# EAGLE design D-Sub Adapter (EAGLE 6.6.0)
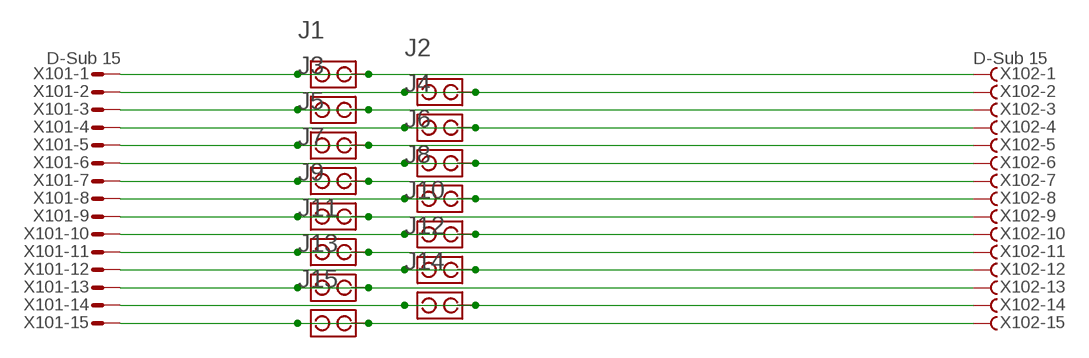
[diagram p0: schematic, sheet 1]

## Parts
J1  JUMPER  [JUMPER]
J2  JUMPER  [JUMPER]
J3  JUMPER  [JUMPER]
J4  JUMPER  [JUMPER]
J5  JUMPER  [JUMPER]
J6  JUMPER  [JUMPER]
J7  JUMPER  [JUMPER]
J8  JUMPER  [JUMPER]
J9  JUMPER  [JUMPER]
J10  JUMPER  [JUMPER]
J11  JUMPER  [JUMPER]
J12  JUMPER  [JUMPER]
J13  JUMPER  [JUMPER]
J14  JUMPER  [JUMPER]
J15  JUMPER  [JUMPER]
X101  D-Sub 15  M15HPS  [M15HP]
X102  D-Sub 15  F15HPS  [F15HP]

## Nets
N$1: J1.1 J1.2 X101.1 X102.1
N$2: J2.1 J2.2 X101.2 X102.2
N$3: J3.1 J3.2 X101.3 X102.3
N$4: J4.1 J4.2 X101.4 X102.4
N$5: J5.1 J5.2 X101.5 X102.5
N$6: J6.1 J6.2 X101.6 X102.6
N$7: J7.1 J7.2 X101.7 X102.7
N$8: J8.1 J8.2 X101.8 X102.8
N$9: J9.1 J9.2 X101.9 X102.9
N$10: J10.1 J10.2 X101.10 X102.10
N$11: J11.1 J11.2 X101.11 X102.11
N$12: J12.1 J12.2 X101.12 X102.12
N$13: J13.1 J13.2 X101.13 X102.13
N$14: J14.1 J14.2 X101.14 X102.14
N$15: J15.1 J15.2 X101.15 X102.15

## Library data of the parts
J1-J15 = MECHANIC:JUMPER
X101 = con-subd:M15?S: SUB-D; OC_FARNELL: unknown; OC_NEWARK: unknown
X102 = con-subd:F15?S: SUB-D; OC_FARNELL: unknown; OC_NEWARK: unknown

## Board
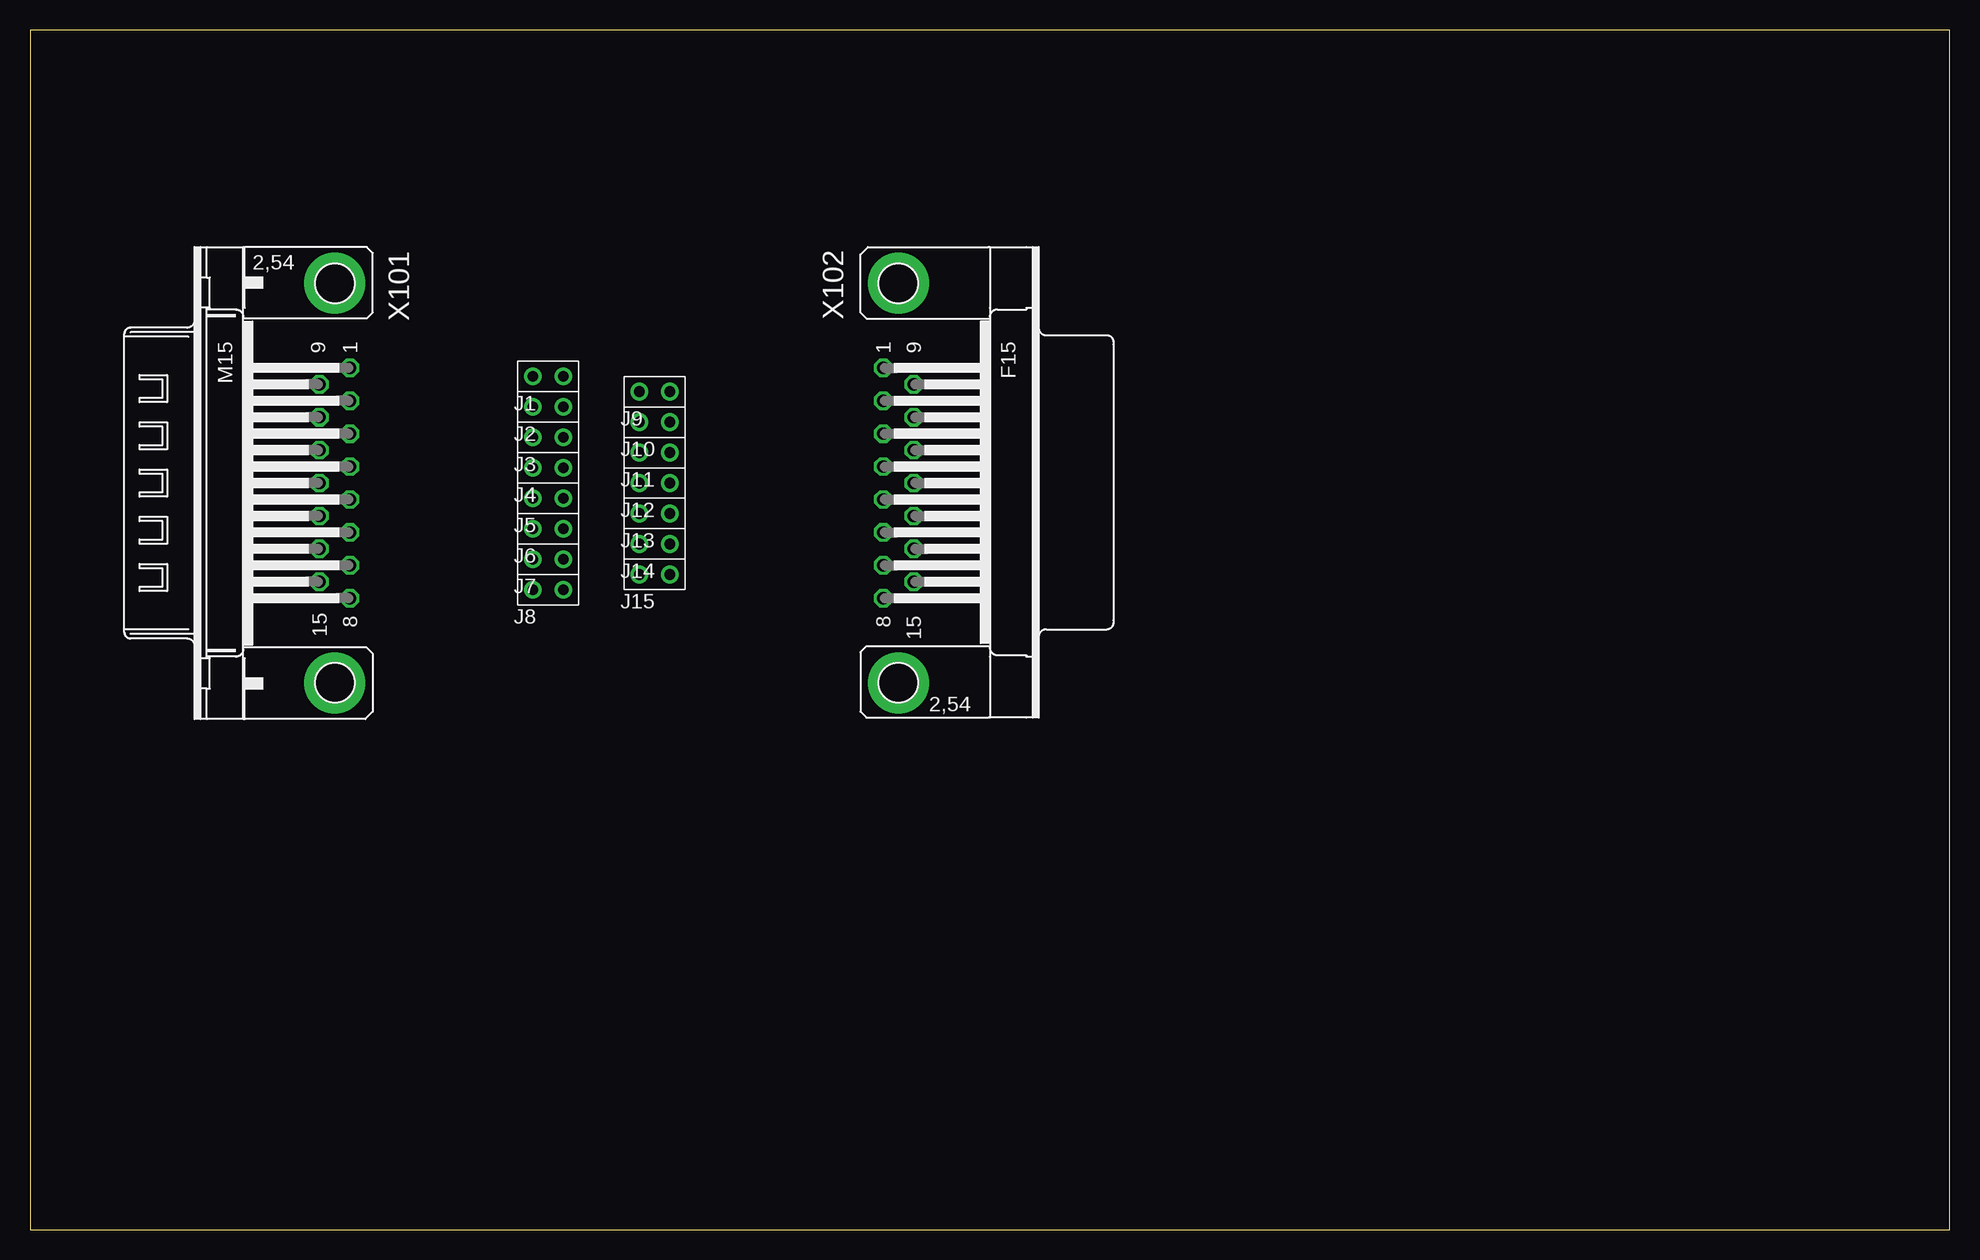
[diagram p1: board, top side]
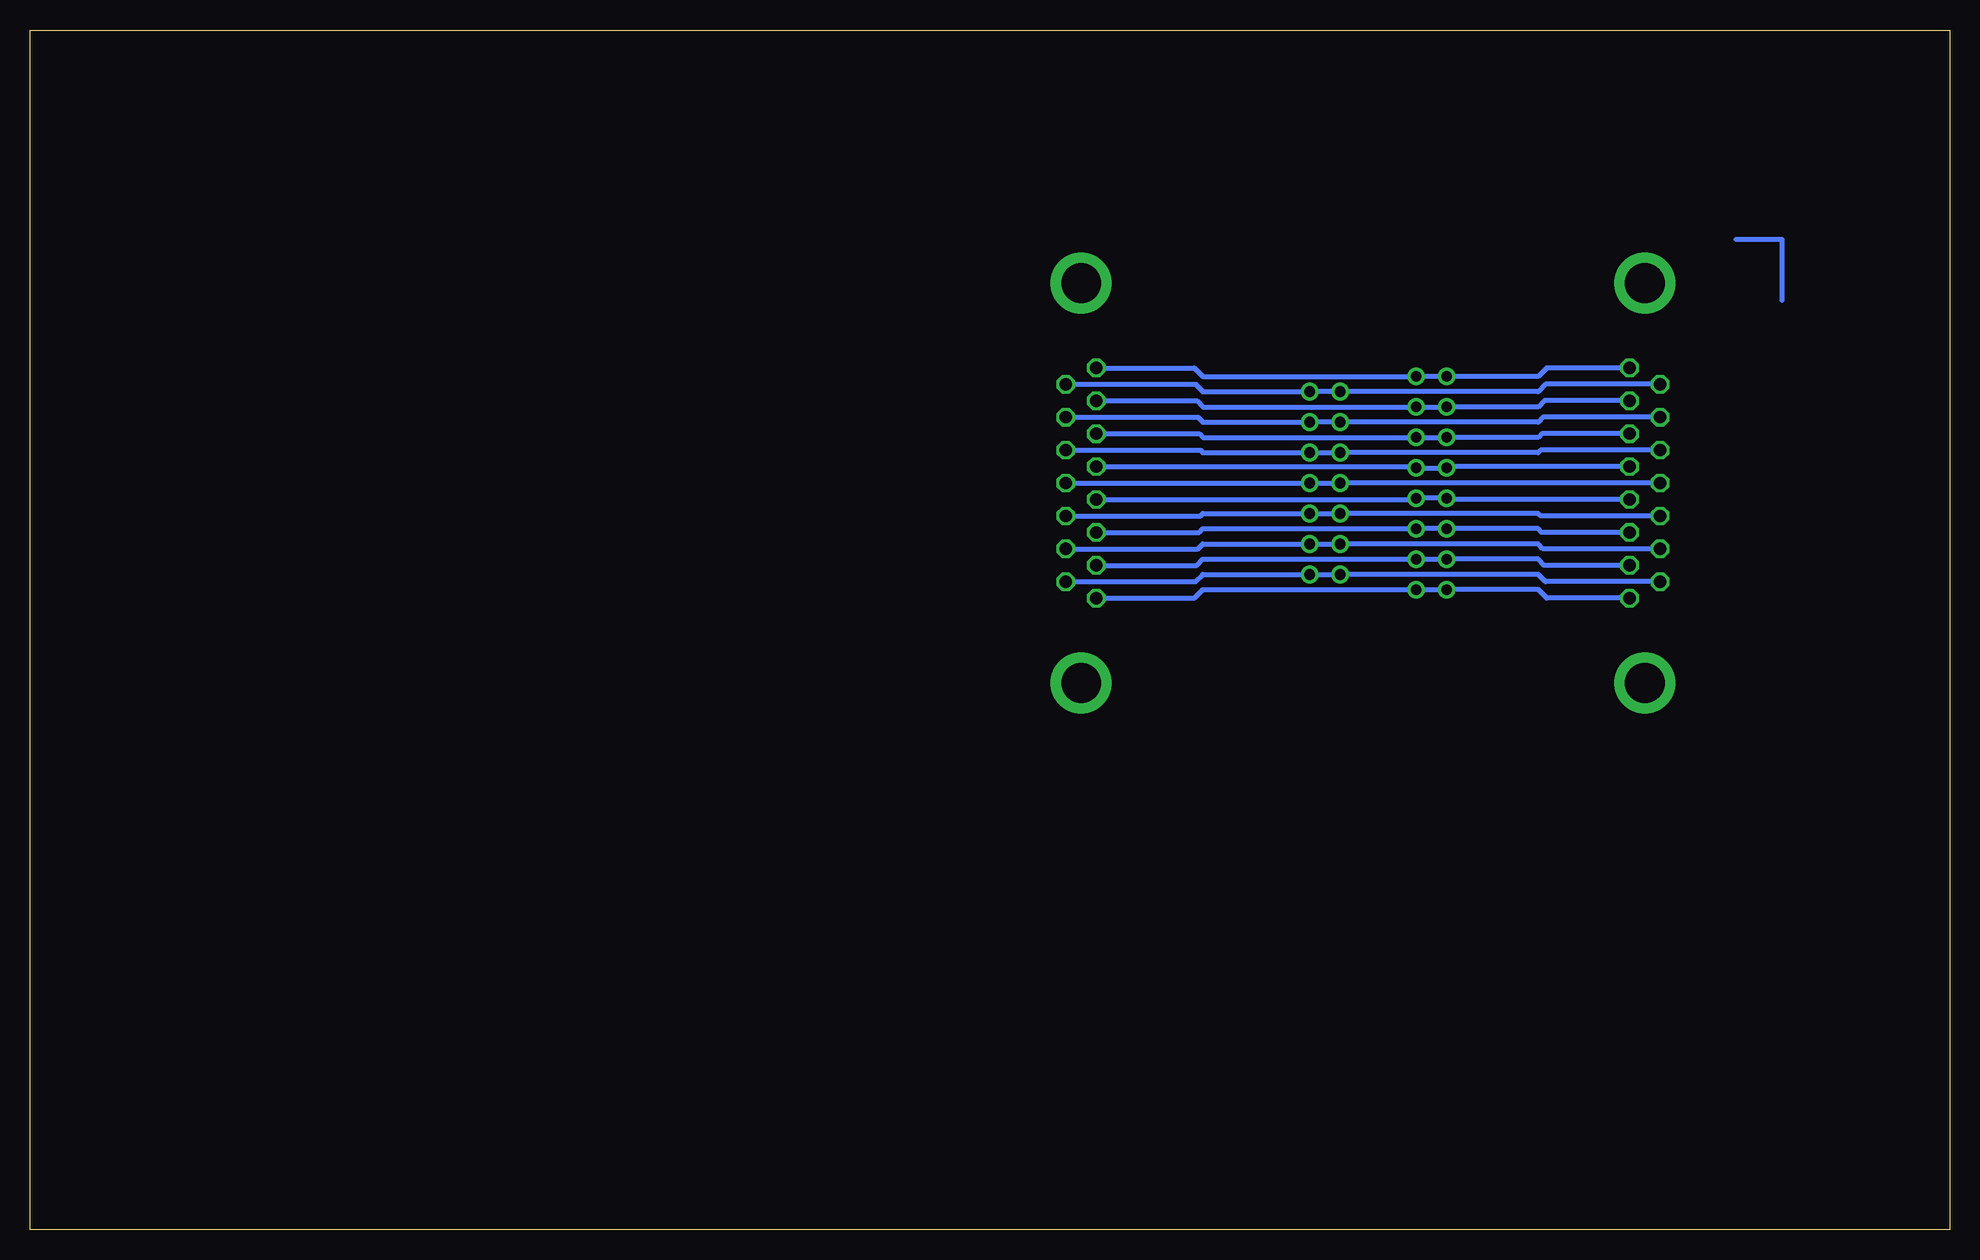
[diagram p2: board, bottom side, seen from below]

Size 160 x 100 mm. Coordinates in mm from the lower left corner, seen from the top.
Outline: 0,0 160,0 160,100 0,100 0,0
Copper layers (1*16): Top 0.035mm / dielectric 1.5mm / Bottom 0.035mm
Design rules "default": minimum track width 10mil, minimum drill 24mil, track to track 8mil, track to pad 8mil, pad to pad 8mil, via to via 8mil, smd to smd 8mil, copper to edge 40mil, drill to drill 8mil, minimum pad ring 10mil, minimum via ring 8mil, stop-mask expansion 4mil, vias tented up to drill 0mil, thermal gap 10mil

### Footprints (pad centres in the part's own frame; a part is rotated, then mirrored left to right if it is on the bottom)
JUMPER = drill 0.9 pad 1.473: 1 1.27,0; 2 -1.27,0
M15HP = drill 1.016 octagon: 1 -9.601,1.27; 2 -6.858,1.27; 3 -4.115,1.27; 4 -1.372,1.27; 5 1.372,1.27; 6 4.115,1.27; 7 6.858,1.27; 8 9.601,1.27; 9 -8.23,-1.27; 10 -5.486,-1.27; 11 -2.743,-1.27; 12 0,-1.27; 13 2.743,-1.27; 14 5.486,-1.27; 15 8.23,-1.27 | drill 3.302 pad 5.08: G1 -16.662,0; G2 16.662,0
F15HP = drill 1.016 octagon: 1 -9.601,-1.27; 2 -6.858,-1.27; 3 -4.115,-1.27; 4 -1.372,-1.27; 5 1.372,-1.27; 6 4.115,-1.27; 7 6.858,-1.27; 8 9.601,-1.27; 9 -8.23,1.27; 10 -5.486,1.27; 11 -2.743,1.27; 12 0,1.27; 13 2.743,1.27; 14 5.486,1.27; 15 8.23,1.27 | drill 3.302 pad 5.08: G1 -16.662,0; G2 16.662,0

### Placement (x,y rotation side)
J1  43.18,71.12 0 top
J2  43.18,68.58 0 top
J3  43.18,66.04 0 top
J4  43.18,63.5 0 top
J5  43.18,60.96 0 top
J6  43.18,58.42 0 top
J7  43.18,55.88 0 top
J8  43.18,53.34 0 top
J9  52.07,69.85 0 top
J10  52.07,67.31 0 top
J11  52.07,64.77 0 top
J12  52.07,62.23 0 top
J13  52.07,59.69 0 top
J14  52.07,57.15 0 top
J15  52.07,54.61 0 top
X101  25.4,62.23 270 top
X102  72.39,62.23 270 top

### Tracks (layer width: path | path; a pad name or v marks a point on that pad's centre or on a via)
N$1
  Bottom 0.406: X101.1 33.58,71.83 34.29,71.12 J1.2 J1.1 62.23,71.12 62.94,71.83 X102.1
N$2
  Bottom 0.406: X101.2 33.78,69.09 34.29,68.58 J2.2 J2.1 62.23,68.58 62.74,69.09 X102.2
N$3
  Bottom 0.406: X102.3 62.53,66.34 62.23,66.04 J3.1 J3.2 34.29,66.04 33.98,66.34 X101.3
N$4
  Bottom 0.406: X102.4 44.55,63.6 J4.1 J4.2 41.81,63.6 X101.4
N$5
  Bottom 0.406: X102.5 44.55,60.86 J5.1 J5.2 41.81,60.86 X101.5
N$6
  Bottom 0.406: X102.6 62.53,58.12 62.23,58.42 J6.1 J6.2 34.29,58.42 33.98,58.12 X101.6
N$7
  Bottom 0.406: X102.7 62.74,55.37 62.23,55.88 J7.1 J7.2 34.29,55.88 33.78,55.37 X101.7
N$8
  Bottom 0.406: X102.8 62.94,52.63 62.23,53.34 J8.1 J8.2 34.29,53.34 33.58,52.63 X101.8
N$9
  Bottom 0.406: X101.9 33.68,70.46 34.29,69.85 J9.2 J9.1 62.23,69.85 62.84,70.46 X102.9
N$10
  Bottom 0.406: X102.10 62.64,67.72 62.23,67.31 J10.1 J10.2 34.29,67.31 33.88,67.72 X101.10
N$11
  Bottom 0.406: X102.11 62.43,64.97 62.23,64.77 J11.1 J11.2 34.29,64.77 34.09,64.97 X101.11
N$12
  Bottom 0.406: X102.12 J12.1 J12.2 X101.12
N$13
  Bottom 0.406: X102.13 62.43,59.49 62.23,59.69 J13.1 J13.2 34.29,59.69 34.09,59.49 X101.13
N$14
  Bottom 0.406: X102.14 62.64,56.74 62.23,57.15 J14.1 J14.2 34.29,57.15 33.88,56.74 X101.14
N$15
  Bottom 0.406: X102.15 62.84,54 62.23,54.61 J15.1 J15.2 34.29,54.61 33.68,54 X101.15
N$16
  Bottom 0.406: 17.78,82.55 13.97,82.55 13.97,77.47